# EAGLE design BusinessCard (EAGLE 7.4.0)
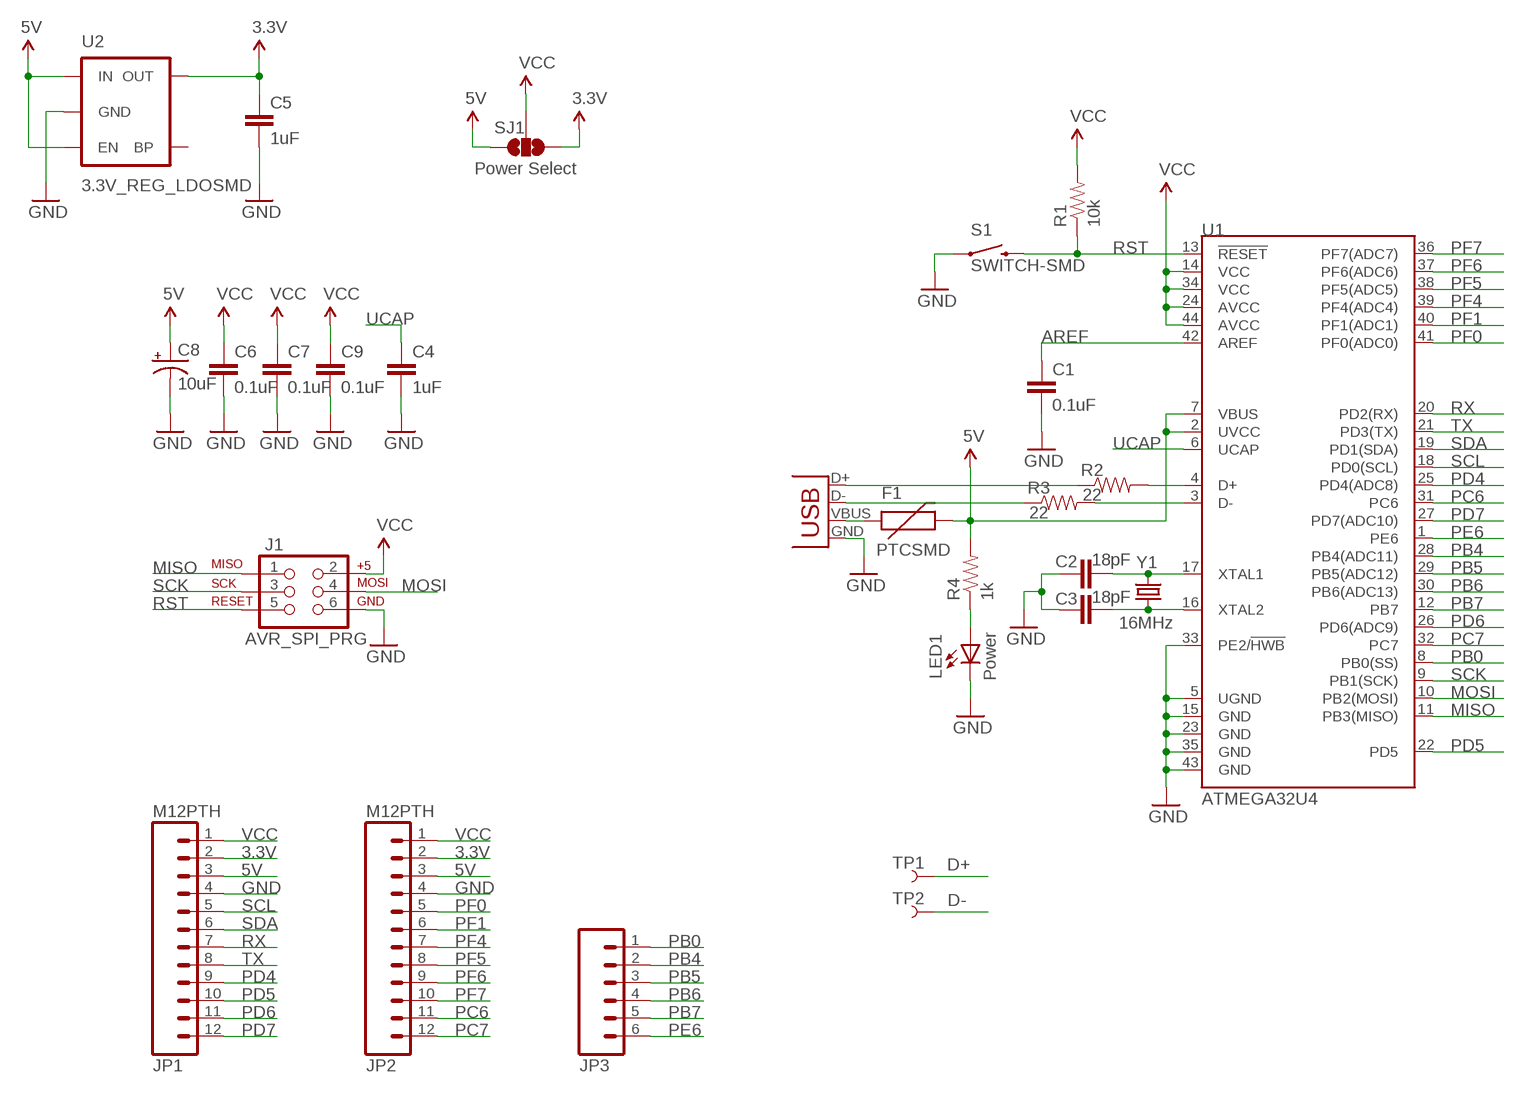
[diagram p0: schematic, sheet 1]

## Parts
C1  0.1uF  CAP0402-CAP  [0402-CAP]
C2  18pF  CAP0402-CAP  [0402-CAP]
C3  18pF  CAP0402-CAP  [0402-CAP]
C4  1uF  CAP0402-CAP  [0402-CAP]
C5  1uF  CAP0402-CAP  [0402-CAP]
C6  0.1uF  CAP0402-CAP  [0402-CAP]
C7  0.1uF  CAP0402-CAP  [0402-CAP]
C8  10uF  CAP_POL1206  [EIA3216]
C9  0.1uF  CAP0402-CAP  [0402-CAP]
F1  PTCSMD  [PTC-1206]
J1  AVR_SPI_PRG  AVR_SPI_PRG_6PTH  [2X3]
JP1  M12PTH  [1X12]
JP2  M12PTH  [1X12]
JP3  M06SIP  [1X06]
LED1  Power  LED0603  [LED-0603]
R1  10k  RESISTOR0402-RES  [0402-RES]
R2  22  RESISTOR0402-RES  [0402-RES]
R3  22  RESISTOR0402-RES  [0402-RES]
R4  1k  RESISTOR0402-RES  [0402-RES]
S1  SWITCH-SMD  SWITCH-MOMENTARY-2SMD  [TACTILE_SWITCH_SMD]
SJ1  Power Select  SOLDERJUMPER_2WAYPASTE2&3  [SJ_3_PASTE2&3]
TP1  TEST-POINT3  [PAD.03X.03]
TP2  TEST-POINT3  [PAD.03X.03]
U1  ATMEGA32U4  ATMEGA32U4QFN2  [QFN-44-NOPAD]
U2  3.3V_REG_LDOSMD  V_REG_LDOSMD  [SOT23-5]
X1  USBSMD  [USB-MINIB]
Y1  16MHz  CRYSTAL5X3  [CRYSTAL-SMD-5X3]

## Nets
3.3V: C5.1 JP1.2 JP2.2 SJ1.1 U2.5(OUT)
5V: C8.A(+) F1.2 JP1.3 JP2.3 R4.2 SJ1.3 U1.2(UVCC) U1.7(VBUS) U2.1(IN) U2.3(EN)
AREF: C1.1 U1.42(AREF)
D+: R2.1 TP1.P$1 X1.D+
D-: R3.1 TP2.P$1 X1.D-
GND: C1.2 C2.1 C3.1 C4.2 C5.2 C6.2 C7.2 C8.C(-) C9.2 J1.6 JP1.4 JP2.4 LED1.C S1.1 U1.5(UGND) U1.15(GND) U1.23(GND) U1.33(PE2/!HWB) U1.35(GND) U1.43(GND) U2.2(GND) X1.GND
MISO: J1.1 U1.11(PB3(MISO))
MOSI: J1.4 U1.10(PB2(MOSI))
N$2: C2.2 U1.17(XTAL1) Y1.3
N$3: C3.2 U1.16(XTAL2) Y1.1
N$4: F1.1 X1.VBUS
N$6: R2.2 U1.4(D+)
N$8: R3.2 U1.3(D-)
N$9: LED1.A R4.1
PB0: JP3.1 U1.8(PB0(SS))
PB4: JP3.2 U1.28(PB4(ADC11))
PB5: JP3.3 U1.29(PB5(ADC12))
PB6: JP3.4 U1.30(PB6(ADC13))
PB7: JP3.5 U1.12(PB7)
PC6: JP2.11 U1.31(PC6)
PC7: JP2.12 U1.32(PC7)
PD4: JP1.9 U1.25(PD4(ADC8))
PD5: JP1.10 U1.22(PD5)
PD6: JP1.11 U1.26(PD6(ADC9))
PD7: JP1.12 U1.27(PD7(ADC10))
PE6: JP3.6 U1.1(PE6)
PF0: JP2.5 U1.41(PF0(ADC0))
PF1: JP2.6 U1.40(PF1(ADC1))
PF4: JP2.7 U1.39(PF4(ADC4))
PF5: JP2.8 U1.38(PF5(ADC5))
PF6: JP2.9 U1.37(PF6(ADC6))
PF7: JP2.10 U1.36(PF7(ADC7))
RST: J1.5 R1.1 S1.3 U1.13(!RESET)
RX: JP1.7 U1.20(PD2(RX))
SCK: J1.3 U1.9(PB1(SCK))
SCL: JP1.5 U1.18(PD0(SCL))
SDA: JP1.6 U1.19(PD1(SDA))
TX: JP1.8 U1.21(PD3(TX))
UCAP: C4.1 U1.6(UCAP)
VCC: C6.1 C7.1 C9.1 J1.2 JP1.1 JP2.1 R1.2 SJ1.2 U1.14(VCC) U1.24(AVCC) U1.34(VCC) U1.44(AVCC)
Unconnected: U2.4(BP)

## Library data of the parts
C1-C7 C9 = SparkFun:CAP: Capacitor Standard 0603 ceramic capacitor, and 0.1" leaded capacitor.
C8 = SparkFun:CAP_POL: Capacitor Polarized These are standard SMD and PTH capacitors. Normally 10uF, 47uF, and 100uF in electrolytic and tantalum varieties. Always verify the external diameter of the through hole cap, it varies with capacity, voltage, and manufacturer. The EIA devices should be standard.
F1 = SparkFun:PTC: Resettable Fuse PTC Resettable Fuse. Spark Fun Electronics SKU : COM-08357
J1 = SparkFun:AVR_SPI_PRG_6: AVR ISP 6 Pin This is the reduced ISP connector for AVR programming. Common on Arduino. This footprint will take up less PCB space and can be used with a 10-pin to 6-pin adapter such as SKU: BOB-08508
JP1 JP2 = SparkFun:M12: Header 12 Standard 12-pin 0.1" header. Use with straight break away headers (SKU : PRT-00116), right angle break away headers (PRT-00553), swiss pins (PRT-00743), machine pins (PRT-00117), and female headers (PRT-00115).
JP3 = SparkFun:M06: Header 6 Standard 6-pin 0.1" header. Use with straight break away headers (SKU : PRT-00116), right angle break away headers (PRT-00553), swiss pins (PRT-00743), machine pins (PRT-00117), and female headers (PRT-00115). Molex polarized connector foot print use with SKU : PRT-08094 with associated crimp pins and housings. NOTES ON THE VARIANTS LOCK and LOCK_LONGPADS... This footprint was designed to help hold the alignment of a through-hole component (i.e. 6-pin header) while soldering it into place. You may notice that each hole has been shifted either up or down by 0.005 of an inch from it's more standard position (which is a perfectly straight line). This slight alteration caused the pins (the squares in the middle) to touch the edges of the holes. Because they are alternating, it causes a "brace" to hold the component in place. 0.005 has proven to be the perfect amount of "off-center" position when using our standard breakaway headers. Although looks a little odd when you look at the bare footprint, once you have a header in there, the alteration is very hard to notice. Also, if you push a header all the way into place, it is covered up entirely on the bottom side. This idea of altering the position of holes to aid alignment will be further integrated into the Sparkfun Library for other footprints. It can help hold any component with 3 or more connection pins.
LED1 = SparkFun:LED: LEDs Standard schematic elements and footprints for 5mm, 3mm, 1206, and 0603 sized LEDs. 5mm - Spark Fun Electronics SKU : COM-00529 (and others)
R1-R4 = SparkFun:RESISTOR: Resistor Basic schematic elements and footprints for 0603, 1206, and PTH resistors.
S1 = SparkFun:SWITCH-MOMENTARY-2
SJ1 = SparkFun:SOLDERJUMPER_2WAY: Solder Jumper 2 way solder jumper
TP1 TP2 = SparkFun:TEST-POINT
U1 = SparkFun:ATMEGA32U4
U2 = SparkFun:V_REG_LDO: Voltage Regulator LDO Standard 150mA LDO voltage regulator in SOT-23 layout. Micrel part MIC5205. BP (by-pass) pin is used to lower output noise with 470pF cap.
X1 = SparkFun:USB: USB Connectors USB-B-PTH is fully proven SKU : PRT-00139 USB-miniB is fully proven SKU : PRT-00587 USB-A-PCB is untested. USB-A-H is throughly reviewed, but untested. Spark Fun Electronics SKU : PRT-00437 USB-B-SMT is throughly reviewed, but untested. Needs silkscreen touching up. USB-A-S has not been used/tested USB-MB-H has not been used/tested
Y1 = SparkFun:CRYSTAL: Crystals Various standard crystals. Proven footprints. Spark Fun Electronics SKU : COM-00534

## Board
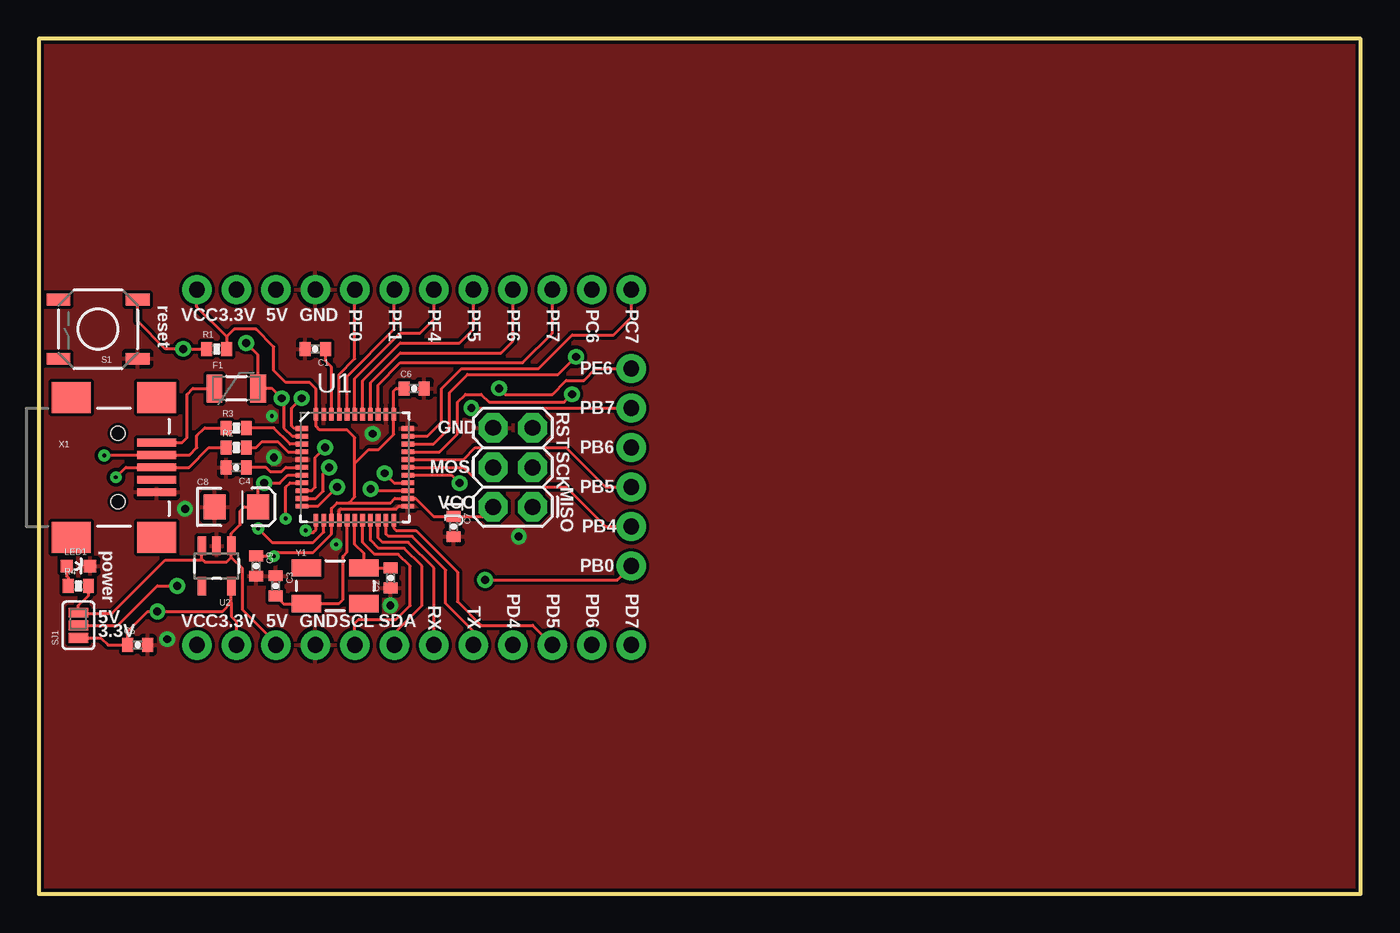
[diagram p1: board, top side]
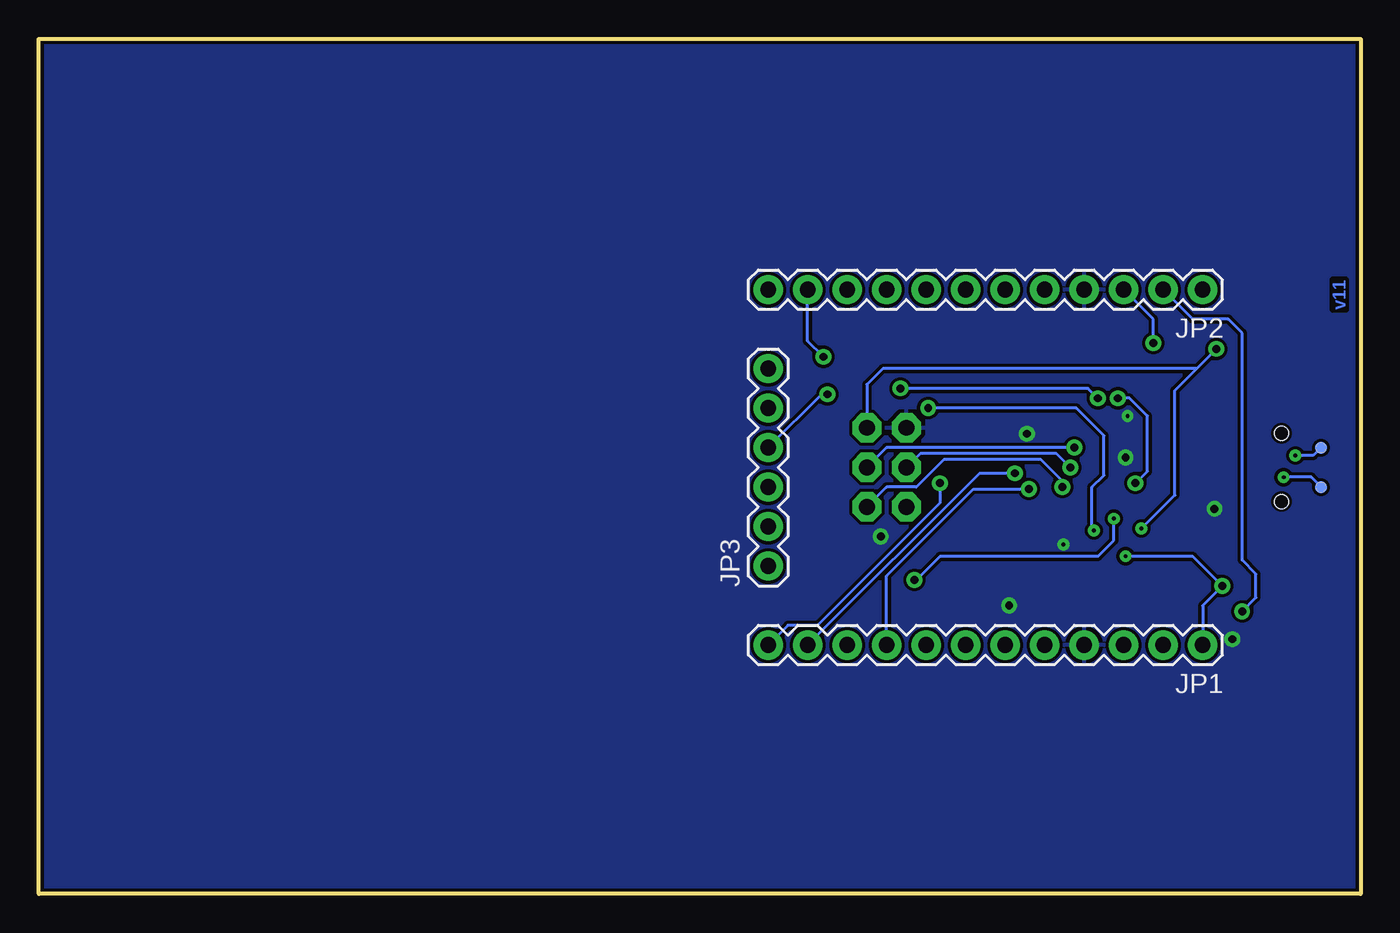
[diagram p2: board, bottom side, seen from below]

Size 85 x 55 mm. Coordinates in mm from the lower left corner, seen from the top.
Outline: 0,0 85,0 85,55 0,55 0,0
Copper layers (1*16): Top 0.035mm / dielectric 1.5mm / Bottom 0.035mm
Design rules "default": minimum track width 8mil, minimum drill 10mil, track to track 7mil, track to pad 7mil, pad to pad 7mil, via to via 8mil, smd to smd 8mil, copper to edge 8mil, drill to drill 8mil, minimum pad ring 12mil, minimum via ring 10mil, stop-mask expansion 4mil, vias tented up to drill 20mil, thermal gap 10mil

### Footprints (pad centres in the part's own frame; a part is rotated, then mirrored left to right if it is on the bottom)
0402-CAP = smd 0.7 x 0.9: 1 -0.65,0; 2 0.65,0
EIA3216 = smd 1.4 x 1.6: A 1.4,0; C -1.4,0
PTC-1206 = smd 1 x 1.8: 1 -1.4,0; 2 1.4,0
2X3 = drill 1.016 pad 1.88 octagon: 1 0,0; 2 0,2.54; 3 2.54,0; 4 2.54,2.54; 5 5.08,0; 6 5.08,2.54
1X12 = drill 1.016 pad 1.88: 1 0,0; 2 2.54,0; 3 5.08,0; 4 7.62,0; 5 10.16,0; 6 12.7,0; 7 15.24,0; 8 17.78,0; 9 20.32,0; 10 22.86,0; 11 25.4,0; 12 27.94,0
1X06 = drill 1.016 pad 1.88: 1 0,0; 2 2.54,0; 3 5.08,0; 4 7.62,0; 5 10.16,0; 6 12.7,0
LED-0603 = smd 0.8 x 0.8: A 0,-0.75; C 0,0.75
0402-RES = smd 0.7 x 0.9: 1 -0.65,0; 2 0.65,0
TACTILE_SWITCH_SMD = smd 1.524 x 0.762: 1 -2.54,1.905; 2 2.54,1.905; 3 -2.54,-1.905; 4 2.54,-1.905
SJ_3_PASTE2&3 = smd 0.635 x 1.27: 1 -0.813,0; 2 0,0; 3 0.813,0
PAD.03X.03 = smd 0.762 x 0.762: P$1 0,0
QFN-44-NOPAD = smd 0.8 x 0.3: 1 -3.4,2.5; 2 -3.4,2; 3 -3.4,1.5; 4 -3.4,1; 5 -3.4,0.5; 6 -3.4,0; 7 -3.4,-0.5; 8 -3.4,-1; 9 -3.4,-1.5; 10 -3.4,-2; 11 -3.4,-2.5; 23 3.4,-2.5; 24 3.4,-2; 25 3.4,-1.5; 26 3.4,-1; 27 3.4,-0.5; 28 3.4,0; 29 3.4,0.5; 30 3.4,1; 31 3.4,1.5; 32 3.4,2; 33 3.4,2.5 | smd 0.3 x 0.8: 12 -2.5,-3.4; 13 -2,-3.4; 14 -1.5,-3.4; 15 -1,-3.4; 16 -0.5,-3.4; 17 0,-3.4; 18 0.5,-3.4; 19 1,-3.4; 20 1.5,-3.4; 21 2,-3.4; 22 2.5,-3.4; 34 2.5,3.4; 35 2,3.4; 36 1.5,3.4; 37 1,3.4; 38 0.5,3.4; 39 0,3.4; 40 -0.5,3.4; 41 -1,3.4; 42 -1.5,3.4; 43 -2,3.4; 44 -2.5,3.4
SOT23-5 = smd 0.55 x 1.2: 1 -0.95,-1.3; 2 0,-1.3; 3 0.95,-1.3; 4 0.95,1.3; 5 -0.95,1.3
USB-MINIB = smd 2.5 x 0.5: D+ 2.5,0; D- 2.5,0.8; GND 2.5,-1.6; ID 2.5,-0.8; VBUS 2.5,1.6 | smd 2.5 x 2: MTN1 -3,4.5; MTN2 2.5,4.5; MTN3 -3,-4.5; MTN4 2.5,-4.5 | hole 0.9: 0,2.2; 0,-2.2
CRYSTAL-SMD-5X3 = smd 1.9 x 1.1: 1 -1.85,-1.15; 2 1.85,-1.15; 3 1.85,1.15; 4 -1.85,1.15

### Placement (x,y rotation side)
C1  17.78,35.06 180 top
C2  22.61,20.33 90 top
C3  15.24,19.82 270 top
C4  12.7,27.44 180 top
C5  6.35,16.01 0 top
C6  24.13,32.52 0 top
C7  26.67,23.63 270 top
C8  12.7,24.9 0 top
C9  13.97,21.09 270 top
F1  12.7,32.52 0 top
J1  31.75,24.9 90 top
JP1  10.16,16.01 180 bottom
JP2  10.16,38.87 180 bottom
JP3  38.1,21.09 90 bottom
LED1  2.54,21.09 270 top
R1  11.43,35.06 0 top
R2  12.7,28.71 0 top
R3  12.7,29.98 0 top
R4  2.54,19.82 0 top
S1  3.81,36.33 180 top
SJ1  2.54,17.28 90 top
TP1  2.54,26.17 0 bottom
TP2  2.54,28.71 0 bottom
U1  20.32,27.44 0 top
U2  11.43,21.09 180 top
X1  5.08,27.44 0 top
Y1  19.05,19.82 0 top

### Tracks (layer width: path | path; a pad name or v marks a point on that pad's centre or on a via)
3.3V  (via drill 0.51)
  Top 0.203: SJ1.1 3.99,16.47 4.45,16.01 C5.1 5.71,16.02 5.71,16.9 6.99,18.17 v7.62,18.17 11.81,18.17 12.38,18.74 | 12.38,18.74 U2.5 | 12.38,18.74 12.38,17.85 12.7,17.53 JP1.2
  Bottom 0.203: JP2.2 10.79,36.97 8.51,36.97 7.62,36.08 7.62,21.47 6.73,20.58 6.73,19.06 v7.62,18.17
5V  (via drill 0.51)
  Top 0.203: U1.2 16.29,29.44 15.75,29.98 15.75,31.76 v15.62,31.88 14.99,32.52 F1.2 14.1,34.68 v13.34,35.44 | U2.1 12.41,22.36 | 10.48,21.53 U2.3 | 10.48,21.53 10.67,21.34 12.06,21.34 12.38,21.66 | 12.38,21.66 U2.1 | 10.48,21.53 10.42,21.47 8.13,21.47 4.7,18.04 2.59,18.04 SJ1.3 2.54,18.55 3.19,19.2 R4.2 | U2.1 12.38,23.18 12.95,23.76 12.95,24.65 13.21,24.9 C8.A 14.1,26.04 v14.48,26.42 15.49,26.42 16.01,26.94 U1.7 | JP1.3 15.24,16.14 13.08,18.3 13.08,20.96 12.38,21.66
  Bottom 0.203: v13.34,35.44 13.34,36.97 JP2.3 | v14.48,26.42 13.72,27.19 13.72,30.74 14.86,31.88 v15.62,31.88
AREF
  Top 0.203: U1.42 18.82,33.89 18.43,34.28 C1.1
D+  (via drill 0.25)
  Top 0.203: R2.1 10.92,28.71 9.65,27.44 X1.D+ 5.59,27.44 v4.95,26.8
  Bottom 0.203: v4.95,26.8 3.17,26.8 TP1.P$1
D-  (via drill 0.25)
  Top 0.203: R3.1 10.67,29.98 10.16,29.47 10.16,28.71 9.69,28.24 X1.D- 4.23,28.24 v4.19,28.2
  Bottom 0.203: v4.19,28.2 3.05,28.2 TP2.P$1
GND  (via drill 0.25, 0.51)
  Top 0.203: U1.15 19.32,24.66 19.43,24.77 22.99,24.77 23.15,24.94 U1.23 23.68,24.9
  other vias: 15.11,28.07 9.4,24.77 8.26,16.39 22.61,18.55 30.86,23 21.46,29.6 19.13,22.47 14.99,30.74
  pour Top (isolate 0.203): 85,55 0,55 0,0 85,0
  pour Bottom (isolate 0.203): 85,55 85,0 0,0 0,55
MISO  (via drill 0.51)
  Top 0.203: U1.11 17.95,24.94 v19.18,26.17
  Bottom 0.203: J1.1 30.48,26.17 28.57,26.17 26.8,27.95 20.57,27.95 19.18,26.55 v19.18,26.17
MOSI  (via drill 0.51)
  Top 0.203: U1.10 17.81,25.44 18.29,25.92 18.29,27.06 v18.67,27.44
  Bottom 0.203: v18.67,27.44 19.56,28.33 28.32,28.33 J1.4
N$2
  Top 0.203: U1.17 20.32,22.49 20.9,21.91 Y1.3 | Y1.3 20.9,20.64 | C2.2 22.6,20.97 Y1.3
N$3
  Top 0.203: C3.2 15.74,18.67 Y1.1 19.3,18.68 19.56,18.93 19.56,21.73 19.82,21.99 U1.16
N$4
  Top 0.203: X1.VBUS 9.22,29.04 9.53,29.34 9.53,32.14 9.91,32.52 F1.1
N$6
  Top 0.203: U1.4 16.02,28.44 15.37,29.09 14.35,29.09 13.97,28.71 R2.2
N$8
  Top 0.203: 16.9,28.96 U1.3 16.15,28.94 15.11,29.98 R3.2
N$9
  Top 0.203: R4.1 1.89,20.31 1.91,20.33 1.79,20.44 LED1.A
PB0  (via drill 0.25, 0.51)
  Top 0.203: U1.8 16.14,26.44 15.88,26.17 v15.88,24.14 | JP3.1 37.21,20.2 v28.7,20.2
  Bottom 0.203: v28.7,20.2 28.57,20.2 27.05,21.73 16.89,21.73 15.88,22.74 v15.88,24.14
PB4
  Top 0.203: U1.28 27.3,27.44 28.57,26.17 33.91,26.17 36.45,23.63 JP3.2
PB5
  Top 0.203: U1.29 27.3,27.94 28.07,28.71 33.91,28.71 36.45,26.17 JP3.3
PB6  (via drill 0.51)
  Top 0.203: U1.30 25.77,28.44 26.92,29.6 26.92,31.63 27.43,32.14 28.45,32.14 28.96,31.63 33.78,31.63 v34.29,32.14
  Bottom 0.203: v34.29,32.14 34.67,32.14 JP3.4
PB7  (via drill 0.25, 0.51)
  Top 0.203: v27.81,31.25 JP3.5 | U1.12 17.82,23.42 17.65,23.25 17.27,23.25 v17.14,23.38
  Bottom 0.203: v27.81,31.25 18.29,31.25 16.51,29.47 16.51,26.93 17.27,26.17 17.27,23.5 v17.14,23.38
PC6  (via drill 0.51)
  Top 0.203: U1.31 25.38,28.94 26.42,29.98 26.42,32.27 27.56,33.41 33.4,33.41 v34.54,34.55
  Bottom 0.203: v34.54,34.55 35.56,35.57 JP2.11
PC7
  Top 0.203: U1.32 24.99,29.44 25.91,30.36 25.91,32.52 27.18,33.79 32.13,33.79 34.29,35.95 36.96,35.95 38.1,37.09 JP2.12
PD4  (via drill 0.51)
  Top 0.203: U1.25 21.44,25.94 v21.34,26.04
  Bottom 0.203: JP1.9 30.48,20.45 24.89,26.04 v21.34,26.04
PD5
  Top 0.203: U1.22 22.82,23.54 22.99,23.38 24.26,23.38 26.92,20.71 26.92,18.8 28.45,17.28 31.75,17.28 JP1.10
PD6  (via drill 0.51)
  Top 0.203: U1.26 22.84,26.44 v22.23,27.06
  Bottom 0.203: JP1.11 24.51,27.06 v22.23,27.06
PD7  (via drill 0.51)
  Top 0.203: U1.27 26.54,26.94 v27.05,26.42
  Bottom 0.203: JP1.12 36.83,17.28 34.92,17.28 27.05,25.15 v27.05,26.42
PE6  (via drill 0.51)
  Top 0.203: JP3.6 35.81,33.79 35.05,33.03 33.91,33.03 33.02,32.14 29.97,32.14 v29.59,32.52 | U1.1 16.42,29.94 16.26,30.11 16.26,31.25 v16.89,31.88
  Bottom 0.203: v29.59,32.52 17.53,32.52 v16.89,31.88
PF0
  Top 0.203: U1.41 19.32,33.42 20.32,34.42 JP2.5
PF1
  Top 0.203: U1.40 19.82,33.29 22.86,36.33 JP2.6
PF4
  Top 0.203: U1.39 20.32,33.16 23.24,36.08 24.51,36.08 25.4,36.97 JP2.7
PF5
  Top 0.203: U1.38 20.82,33.02 23.24,35.44 27.05,35.44 27.94,36.33 JP2.8
PF6
  Top 0.203: U1.37 21.32,32.88 23.24,34.81 29.72,34.81 30.48,35.57 JP2.9
PF7
  Top 0.203: U1.36 21.82,32.75 23.24,34.17 31.11,34.17 33.02,36.08 JP2.10
RST  (via drill 0.25, 0.51)
  Top 0.203: R1.1 v9.27,35.06 8.13,35.06 6.35,36.84 S1.3 | U1.13 18.32,23.28 17.65,22.61 14.99,22.61 v14.1,23.5
  Bottom 0.203: 10.54,33.79 v9.27,35.06 | J1.5 31.75,32.77 30.73,33.79 10.54,33.79 | 10.54,33.79 11.94,32.39 11.94,25.66 v14.1,23.5
RX
  Top 0.203: U1.20 21.82,22.89 22.1,22.61 23.75,22.61 25.4,20.96 JP1.7
SCK  (via drill 0.51)
  Top 0.203: U1.9 17.55,25.94 17.78,26.17 17.78,28.07 v18.41,28.71
  Bottom 0.203: v18.41,28.71 30.48,28.71 J1.3
SCL
  Top 0.203: U1.18 20.82,22.62 21.59,21.85 23.11,21.85 23.88,21.09 23.88,18.55 22.99,17.66 20.57,17.66 20.32,17.41 JP1.5
SDA
  Top 0.203: U1.19 21.32,22.76 21.84,22.23 23.5,22.23 24.64,21.09 24.64,18.55 22.86,16.77 JP1.6
TX
  Top 0.203: U1.21 22.32,23.15 22.48,23 24,23 26.16,20.84 26.16,18.68 27.94,16.9 JP1.8
UCAP
  Top 0.203: U1.6 15.88,27.44 15.62,27.19 14.86,27.19 14.61,27.44 C4.1
VCC  (via drill 0.25, 0.51)
  Top 0.203: SJ1.2 5.08,17.28 7.62,19.82 v8.89,19.82 | C7.1 26.66,24.27 | C7.1 28.59,24.28 J1.2 | 19.94,25.15 19.18,25.15 18.82,24.8 U1.14 18.82,23.15 17.65,21.98 15.37,21.98 v15.11,21.73 13.98,21.73 C9.1 | C7.1 25.39,24.28 24.23,25.44 U1.24 22.89,25.44 22.61,25.15 19.94,25.15 | 20.32,27.69 20.32,25.54 19.94,25.15 | 20.32,27.69 20.32,29.34 19.81,29.85 18.03,29.85 17.82,30.07 U1.44 17.82,32.48 17.4,32.9 15.88,32.9 15.11,33.66 15.11,35.19 13.97,36.33 12.57,36.33 12.08,35.84 | C6.1 22.99,32.52 22.82,32.35 U1.34 22.82,29.56 21.84,28.58 21.21,28.58 20.32,27.69 | 12.08,35.84 R1.2 | JP2.1 10.16,37.76 12.08,35.84
  Bottom 0.203: JP1.1 10.16,18.55 v8.89,19.82 10.79,21.73 v15.11,21.73

### Text on the board
Bottom: v11
tPlace: reset | PF0 | PF1 | PF4 | PF5 | PF6 | PF7 | PC6 | PC7 | VCC | 3.3V | 5V | GND | PE6 | RST | PB7 | GND | SCK | PB6 | MOSI | MISO | PB5 | VCC | PB4 | power | PB0 | PD4 | PD5 | PD6 | PD7 | RX | TX | 5V | VCC | 3.3V | 5V | GND | SCL | SDA | 3.3V
tValues: Jordan McConnell
tDocu: >_Pr0 - Business Card